# Altium project zynq020.PrjPCB
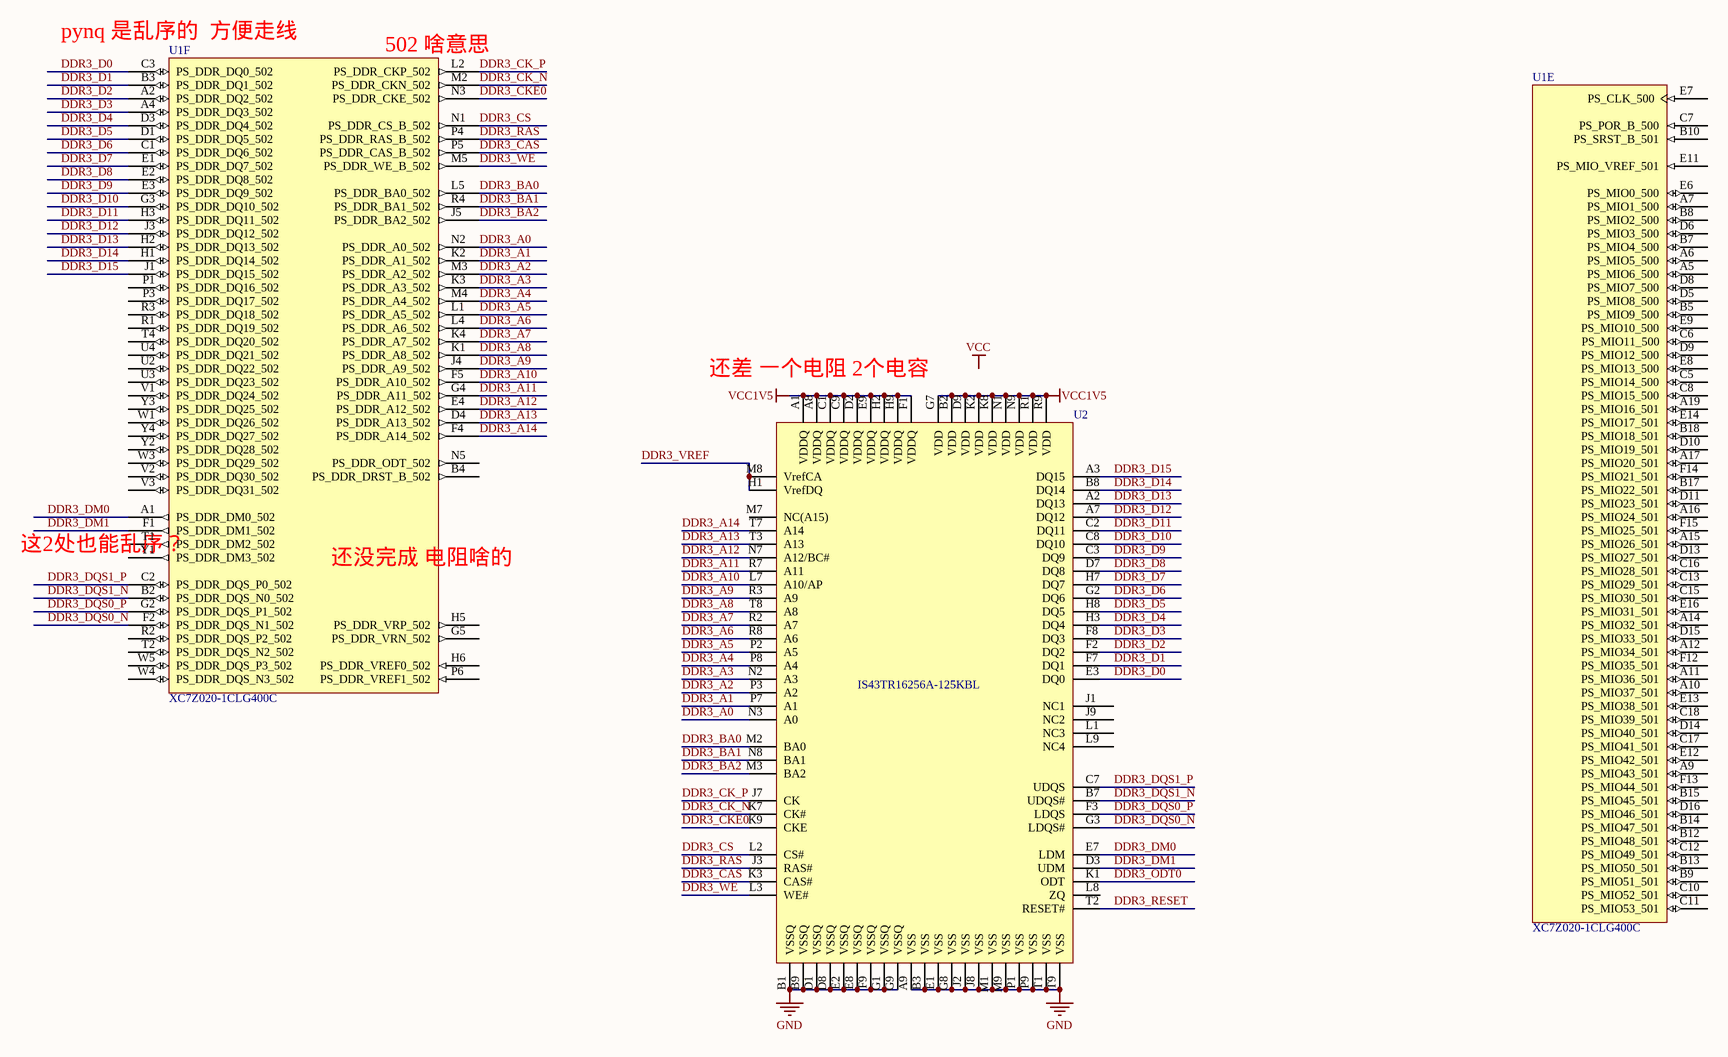
[diagram p0: DDR&MIO.SchDoc]
4 sheets, 54 parts. Net scope: global (net labels, ports and power ports of the same name join across sheets).
Sheets:
  DDR&MIO.SchDoc
  Power&config.SchDoc
  bank.SchDoc
  HDMI.SchDoc

## Sheet DDR&MIO.SchDoc
size A3

### Parts
U1  XC7Z020-1CLG400C  [CLG400]  (parts E,F of 9)
U2  IS43TR16256A-125KBL  [BGA96C80P16X9_1400X900X120]

### Nets
GND: U2.A9(VSS) U2.B1(VSSQ) U2.B3(VSS) U2.B9(VSSQ) U2.D1(VSSQ) U2.D8(VSSQ) U2.E1(VSS) U2.E2(VSSQ) U2.E8(VSSQ) U2.F9(VSSQ) U2.G1(VSSQ) U2.G8(VSS) U2.G9(VSSQ) U2.J2(VSS) U2.J8(VSS) U2.M1(VSS) U2.M9(VSS) U2.P1(VSS) U2.P9(VSS) U2.T1(VSS) U2.T9(VSS)
VCC1V5: U2.A1(VDDQ) U2.A8(VDDQ) U2.B2(VDD) U2.C1(VDDQ) U2.C9(VDDQ) U2.D2(VDDQ) U2.D9(VDD) U2.E9(VDDQ) U2.F1(VDDQ) U2.G7(VDD) U2.H2(VDDQ) U2.H9(VDDQ) U2.K2(VDD) U2.K8(VDD) U2.N1(VDD) U2.N9(VDD) U2.R1(VDD) U2.R9(VDD)
DDR3_A0: U1.N2(PS_DDR_A0_502) U2.N3(A0)
DDR3_A1: U1.K2(PS_DDR_A1_502) U2.P7(A1)
DDR3_A2: U1.M3(PS_DDR_A2_502) U2.P3(A2)
DDR3_A3: U1.K3(PS_DDR_A3_502) U2.N2(A3)
DDR3_A4: U1.M4(PS_DDR_A4_502) U2.P8(A4)
DDR3_A5: U1.L1(PS_DDR_A5_502) U2.P2(A5)
DDR3_A6: U1.L4(PS_DDR_A6_502) U2.R8(A6)
DDR3_A7: U1.K4(PS_DDR_A7_502) U2.R2(A7)
DDR3_A8: U1.K1(PS_DDR_A8_502) U2.T8(A8)
DDR3_A9: U1.J4(PS_DDR_A9_502) U2.R3(A9)
DDR3_A10: U1.F5(PS_DDR_A10_502) U2.L7(A10/AP)
DDR3_A11: U1.G4(PS_DDR_A11_502) U2.R7(A11)
DDR3_A12: U1.E4(PS_DDR_A12_502) U2.N7(A12/BC#)
DDR3_A13: U1.D4(PS_DDR_A13_502) U2.T3(A13)
DDR3_A14: U1.F4(PS_DDR_A14_502) U2.T7(A14)
DDR3_BA0: U1.L5(PS_DDR_BA0_502) U2.M2(BA0)
DDR3_BA1: U1.R4(PS_DDR_BA1_502) U2.N8(BA1)
DDR3_BA2: U1.J5(PS_DDR_BA2_502) U2.M3(BA2)
DDR3_CAS: U1.P5(PS_DDR_CAS_B_502) U2.K3(CAS#)
DDR3_CK_N: U1.M2(PS_DDR_CKN_502) U2.K7(CK#)
DDR3_CK_P: U1.L2(PS_DDR_CKP_502) U2.J7(CK)
DDR3_CKE0: U1.N3(PS_DDR_CKE_502) U2.K9(CKE)
DDR3_CS: U1.N1(PS_DDR_CS_B_502) U2.L2(CS#)
DDR3_D0: U1.C3(PS_DDR_DQ0_502) U2.E3(DQ0)
DDR3_D1: U1.B3(PS_DDR_DQ1_502) U2.F7(DQ1)
DDR3_D2: U1.A2(PS_DDR_DQ2_502) U2.F2(DQ2)
DDR3_D3: U1.A4(PS_DDR_DQ3_502) U2.F8(DQ3)
DDR3_D4: U1.D3(PS_DDR_DQ4_502) U2.H3(DQ4)
DDR3_D5: U1.D1(PS_DDR_DQ5_502) U2.H8(DQ5)
DDR3_D6: U1.C1(PS_DDR_DQ6_502) U2.G2(DQ6)
DDR3_D7: U1.E1(PS_DDR_DQ7_502) U2.H7(DQ7)
DDR3_D8: U1.E2(PS_DDR_DQ8_502) U2.D7(DQ8)
DDR3_D9: U1.E3(PS_DDR_DQ9_502) U2.C3(DQ9)
DDR3_D10: U1.G3(PS_DDR_DQ10_502) U2.C8(DQ10)
DDR3_D11: U1.H3(PS_DDR_DQ11_502) U2.C2(DQ11)
DDR3_D12: U1.J3(PS_DDR_DQ12_502) U2.A7(DQ12)
DDR3_D13: U1.H2(PS_DDR_DQ13_502) U2.A2(DQ13)
DDR3_D14: U1.H1(PS_DDR_DQ14_502) U2.B8(DQ14)
DDR3_D15: U1.J1(PS_DDR_DQ15_502) U2.A3(DQ15)
DDR3_DM0: U1.A1(PS_DDR_DM0_502) U2.E7(LDM)
DDR3_DM1: U1.F1(PS_DDR_DM1_502) U2.D3(UDM)
DDR3_DQS0_N: U1.F2(PS_DDR_DQS_N1_502) U2.G3(LDQS#)
DDR3_DQS0_P: U1.G2(PS_DDR_DQS_P1_502) U2.F3(LDQS)
DDR3_DQS1_N: U1.B2(PS_DDR_DQS_N0_502) U2.B7(UDQS#)
DDR3_DQS1_P: U1.C2(PS_DDR_DQS_P0_502) U2.C7(UDQS)
DDR3_ODT0: U2.K1(ODT)
DDR3_RAS: U1.P4(PS_DDR_RAS_B_502) U2.J3(RAS#)
DDR3_RESET: U2.T2(RESET#)
DDR3_VREF: U2.H1(VrefDQ) U2.M8(VrefCA)
DDR3_WE: U1.M5(PS_DDR_WE_B_502) U2.L3(WE#)

Not connected (* = marked no-connect by the designer): U1 A5(PS_MIO6_500) A6(PS_MIO5_500) A7(PS_MIO1_500) A9(PS_MIO43_501) A10(PS_MIO37_501) A11(PS_MIO36_501) A12(PS_MIO34_501) A14(PS_MIO32_501) A15(PS_MIO26_501) A16(PS_MIO24_501) A17(PS_MIO20_501) A19(PS_MIO16_501) B4(PS_DDR_DRST_B_502) B5(PS_MIO9_500) B7(PS_MIO4_500) B8(PS_MIO2_500) B9(PS_MIO51_501) B10(PS_SRST_B_501) B12(PS_MIO48_501) B13(PS_MIO50_501) B14(PS_MIO47_501) B15(PS_MIO45_501) B17(PS_MIO22_501) B18(PS_MIO18_501) C5(PS_MIO14_500) C6(PS_MIO11_500) C7(PS_POR_B_500) C8(PS_MIO15_500) C10(PS_MIO52_501) C11(PS_MIO53_501) C12(PS_MIO49_501) C13(PS_MIO29_501) C15(PS_MIO30_501) C16(PS_MIO28_501) C17(PS_MIO41_501) C18(PS_MIO39_501) D5(PS_MIO8_500) D6(PS_MIO3_500) D8(PS_MIO7_500) D9(PS_MIO12_500) D10(PS_MIO19_501) D11(PS_MIO23_501) D13(PS_MIO27_501) D14(PS_MIO40_501) D15(PS_MIO33_501) D16(PS_MIO46_501) E6(PS_MIO0_500) E7(PS_CLK_500) E8(PS_MIO13_500) E9(PS_MIO10_500) E11(PS_MIO_VREF_501) E12(PS_MIO42_501) E13(PS_MIO38_501) E14(PS_MIO17_501) E16(PS_MIO31_501) F12(PS_MIO35_501) F13(PS_MIO44_501) F14(PS_MIO21_501) F15(PS_MIO25_501) G5(PS_DDR_VRN_502) H5(PS_DDR_VRP_502) H6(PS_DDR_VREF0_502) N5(PS_DDR_ODT_502) P1(PS_DDR_DQ16_502) P3(PS_DDR_DQ17_502) P6(PS_DDR_VREF1_502) R1(PS_DDR_DQ19_502) R2(PS_DDR_DQS_P2_502) R3(PS_DDR_DQ18_502) T1(PS_DDR_DM2_502) T2(PS_DDR_DQS_N2_502) T4(PS_DDR_DQ20_502) U2(PS_DDR_DQ22_502) U3(PS_DDR_DQ23_502) U4(PS_DDR_DQ21_502) V1(PS_DDR_DQ24_502) V2(PS_DDR_DQ30_502) V3(PS_DDR_DQ31_502) W1(PS_DDR_DQ26_502) W3(PS_DDR_DQ29_502) W4(PS_DDR_DQS_N3_502) W5(PS_DDR_DQS_P3_502) Y1(PS_DDR_DM3_502) Y2(PS_DDR_DQ28_502) Y3(PS_DDR_DQ25_502) Y4(PS_DDR_DQ27_502); U2 J1(NC1) J9(NC2) L1(NC3) L8(ZQ) L9(NC4) M7(NC(A15))

### Notes on the sheet
- (near U1) pynq 是乱序的  方便走线
- (near U1) 502 啥意思
- (near U2) 还差 一个电阻 2个电容
- 这2处也能乱序？
- (near U1) 还没完成 电阻啥的
- Labels drawn without touching a wire or pin: VCC

### Library data of the parts
U1 = XC7Z020-1CLG400C: 667 MHz Zynq?7000 AP SoC, 130 PS I/O, 125 FPGA I/O, 400-Ball BGA, Speed Grade 1, Commercial Grade, Pb-Free; Manufacturer: Xilinx; Extensible Block RAM (# 36Kb Blocks): 560 KB (140); Flip Flops: 106400; LUTs: 53200; Speed Grade: -1; DatasheetVersion: v1.2; PackageVersion: Rev 1.1; PackageReference: CLG400; PackageDescription: Wire-Bond Chip-Scale BGA, Body 17 x 17 mm, 0.8 mm Pitch; Generic Part Number: XC7Z020; RoHS: Pb-Free; Mounting Technology: Surface Mount; Code_JEDEC: MO-275-MMAA-1; PartNumber: XC7Z020-1CLG400C; ComponentLink1Description: Datasheet; ComponentLink1URL: http://www.xilinx.com/support/documentation/data_sheets/ds190-Zynq-7000-Overview.pdf; ComponentLink2Description: Package Specification; ComponentLink2URL: http://www.xilinx.com/support/documentation/user_guides/ug865-Zynq-7000-Pkg-Pinout.pdf; ComponentLink3Description: DC and AC Switching Characteristics; ComponentLink3URL: http://www.xilinx.com/support/documentation/data_sheets/ds187-XC7Z010-XC7Z020-Data-Sheet.pdf; ComponentLink4Description: Package File; ComponentLink4URL: http://www.xilinx.com/support/packagefiles/z7packages/xc7z020clg400pkg.txt; ComponentLink5Description: Packaging and Pinout; ComponentLink5URL: http://www.xilinx.com/support/documentation/user_guides/ug865-Zynq-7000-Pkg-Pinout.pdf; ComponentLink6Description: PCB and Layout Guide; ComponentLink6URL: http://www.xilinx.com/support/documentation/user_guides/ug483_7Series_PCB.pdf
U2 = IS43TR16256A-125KBL: 与MT41K256M16HA-125IT完全兼容

## Sheet Power&config.SchDoc
size A3
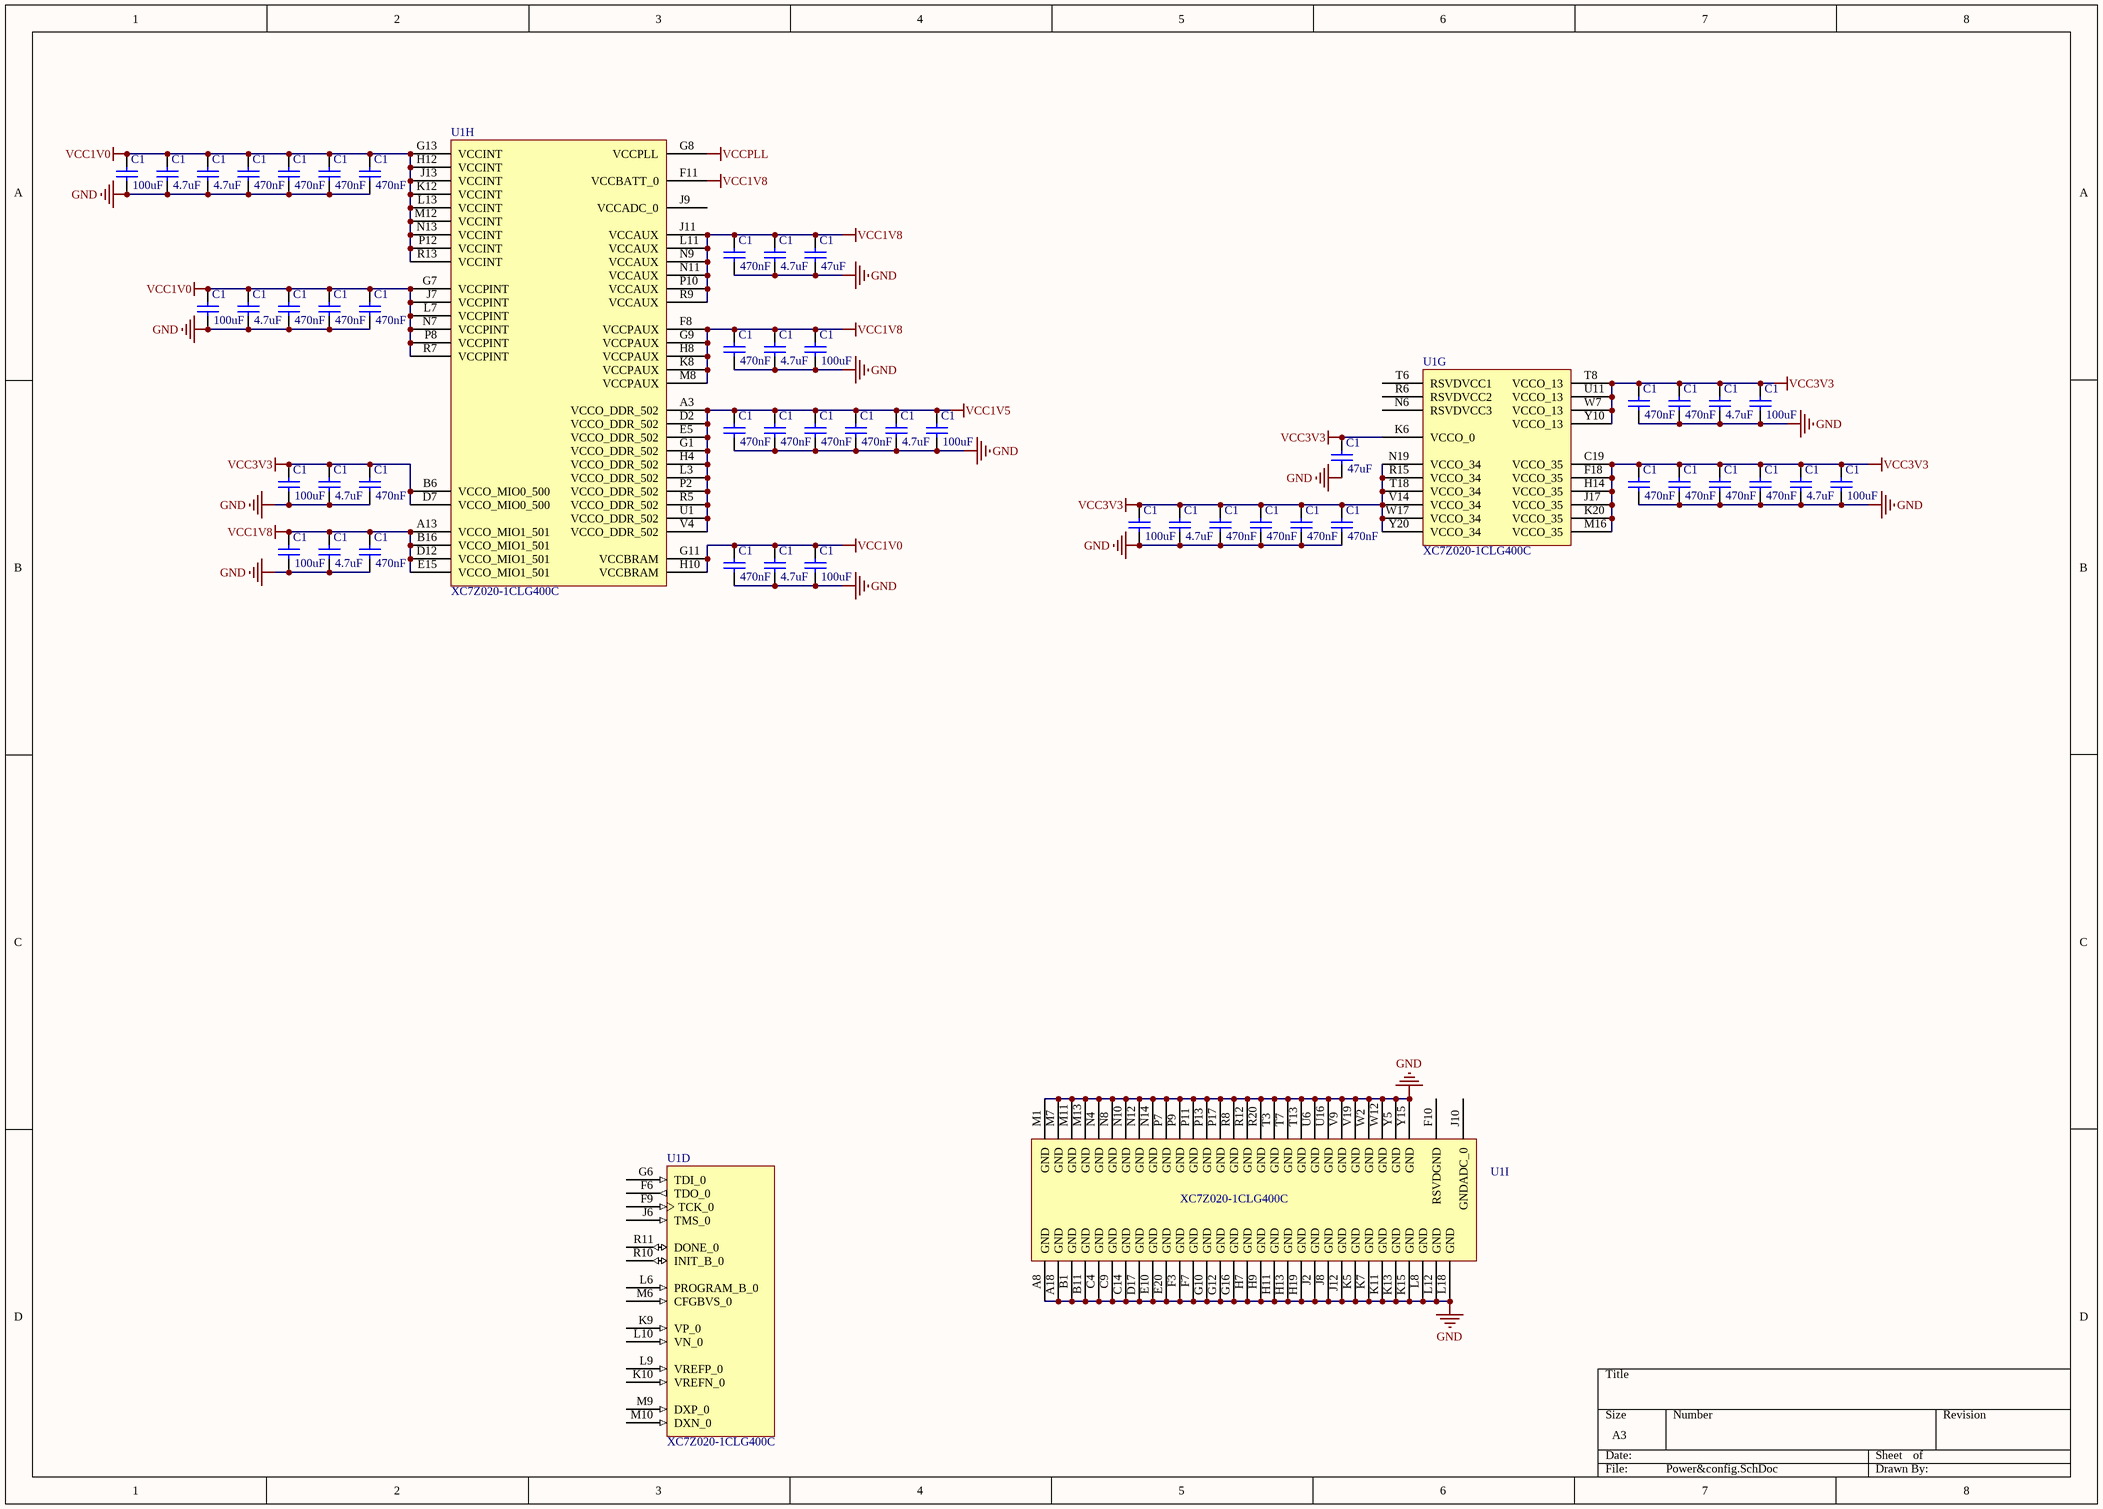
[diagram p1: Power&config.SchDoc]

### Parts
(Parts that share a designator on the sheet are numbered #1, #2 ... from top to bottom, then left to right.)
C1#1  value 100uF  [0402_C]
C1#2  value 4.7uF  [0402_C]
C1#3  value 4.7uF  [0402_C]
C1#4  value 470nF  [0402_C]
C1#5  value 470nF  [0402_C]
C1#6  value 470nF  [0402_C]
C1#7  value 470nF  [0402_C]
C1#8  value 470nF  [0402_C]
C1#9  value 4.7uF  [0402_C]
C1#10  value 47uF  [0402_C]
C1#11  value 100uF  [0402_C]
C1#12  value 4.7uF  [0402_C]
C1#13  value 470nF  [0402_C]
C1#14  value 470nF  [0402_C]
C1#15  value 470nF  [0402_C]
C1#16  value 470nF  [0402_C]
C1#17  value 4.7uF  [0402_C]
C1#18  value 100uF  [0402_C]
C1#19  value 470nF  [0402_C]
C1#20  value 470nF  [0402_C]
C1#21  value 4.7uF  [0402_C]
C1#22  value 100uF  [0402_C]
C1#23  value 470nF  [0402_C]
C1#24  value 470nF  [0402_C]
C1#25  value 470nF  [0402_C]
C1#26  value 470nF  [0402_C]
C1#27  value 4.7uF  [0402_C]
C1#28  value 100uF  [0402_C]
C1#29  value 47uF  [0402_C]
C1#30  value 100uF  [0402_C]
C1#31  value 4.7uF  [0402_C]
C1#32  value 470nF  [0402_C]
C1#33  value 470nF  [0402_C]
C1#34  value 470nF  [0402_C]
C1#35  value 470nF  [0402_C]
C1#36  value 470nF  [0402_C]
C1#37  value 4.7uF  [0402_C]
C1#38  value 100uF  [0402_C]
C1#39  value 100uF  [0402_C]
C1#40  value 4.7uF  [0402_C]
C1#41  value 470nF  [0402_C]
C1#42  value 470nF  [0402_C]
C1#43  value 470nF  [0402_C]
C1#44  value 470nF  [0402_C]
C1#45  value 100uF  [0402_C]
C1#46  value 4.7uF  [0402_C]
C1#47  value 470nF  [0402_C]
C1#48  value 470nF  [0402_C]
C1#49  value 4.7uF  [0402_C]
C1#50  value 100uF  [0402_C]
U1  XC7Z020-1CLG400C  [CLG400]  (parts D,G,H,I of 9)

### Nets
GND: C1#1.1 C1#2.1 C1#3.1 C1#4.1 C1#5.1 C1#6.1 C1#7.1 C1#8.1 C1#9.1 C1#10.1 C1#11.1 C1#12.1 C1#13.1 C1#14.1 C1#15.1 C1#16.1 C1#17.1 C1#18.1 C1#19.1 C1#20.1 C1#21.1 C1#22.1 C1#23.1 C1#24.1 C1#25.1 C1#26.1 C1#27.1 C1#28.1 C1#29.1 C1#30.1 C1#31.1 C1#32.1 C1#33.1 C1#34.1 C1#35.1 C1#36.1 C1#37.1 C1#38.1 C1#39.1 C1#40.1 C1#41.1 C1#42.1 C1#43.1 C1#44.1 C1#45.1 C1#46.1 C1#47.1 C1#48.1 C1#49.1 C1#50.1 U1.A8(GND) U1.A18(GND) U1.B1(GND) U1.B11(GND) U1.C4(GND) U1.C9(GND) U1.C14(GND) U1.D17(GND) U1.E10(GND) U1.E20(GND) U1.F3(GND) U1.F7(GND) U1.G10(GND) U1.G12(GND) U1.G16(GND) U1.H7(GND) U1.H9(GND) U1.H11(GND) U1.H13(GND) U1.H19(GND) U1.J2(GND) U1.J8(GND) U1.J12(GND) U1.K5(GND) U1.K7(GND) U1.K11(GND) U1.K13(GND) U1.K15(GND) U1.L8(GND) U1.L12(GND) U1.L18(GND) U1.M1(GND) U1.M7(GND) U1.M11(GND) U1.M13(GND) U1.N4(GND) U1.N8(GND) U1.N10(GND) U1.N12(GND) U1.N14(GND) U1.P7(GND) U1.P9(GND) U1.P11(GND) U1.P13(GND) U1.P17(GND) U1.R8(GND) U1.R12(GND) U1.R20(GND) U1.T3(GND) U1.T7(GND) U1.T13(GND) U1.U6(GND) U1.U16(GND) U1.V9(GND) U1.V19(GND) U1.W2(GND) U1.W12(GND) U1.Y5(GND) U1.Y15(GND)
VCC1V0: C1#1.2 C1#2.2 C1#3.2 C1#4.2 C1#5.2 C1#6.2 C1#7.2 C1#11.2 C1#12.2 C1#13.2 C1#14.2 C1#15.2 C1#48.2 C1#49.2 C1#50.2 U1.G7(VCCPINT) U1.G11(VCCBRAM) U1.G13(VCCINT) U1.H10(VCCBRAM) U1.H12(VCCINT) U1.J7(VCCPINT) U1.J13(VCCINT) U1.K12(VCCINT) U1.L7(VCCPINT) U1.L13(VCCINT) U1.M12(VCCINT) U1.N7(VCCPINT) U1.N13(VCCINT) U1.P8(VCCPINT) U1.P12(VCCINT) U1.R7(VCCPINT) U1.R13(VCCINT)
VCC1V5: C1#23.2 C1#24.2 C1#25.2 C1#26.2 C1#27.2 C1#28.2 U1.A3(VCCO_DDR_502) U1.D2(VCCO_DDR_502) U1.E5(VCCO_DDR_502) U1.G1(VCCO_DDR_502) U1.H4(VCCO_DDR_502) U1.L3(VCCO_DDR_502) U1.P2(VCCO_DDR_502) U1.R5(VCCO_DDR_502) U1.U1(VCCO_DDR_502) U1.V4(VCCO_DDR_502)
VCC1V8: C1#8.2 C1#9.2 C1#10.2 C1#16.2 C1#17.2 C1#18.2 C1#45.2 C1#46.2 C1#47.2 U1.A13(VCCO_MIO1_501) U1.B16(VCCO_MIO1_501) U1.D12(VCCO_MIO1_501) U1.E15(VCCO_MIO1_501) U1.F8(VCCPAUX) U1.F11(VCCBATT_0) U1.G9(VCCPAUX) U1.H8(VCCPAUX) U1.J11(VCCAUX) U1.K8(VCCPAUX) U1.L11(VCCAUX) U1.M8(VCCPAUX) U1.N9(VCCAUX) U1.N11(VCCAUX) U1.P10(VCCAUX) U1.R9(VCCAUX)
VCC3V3: C1#19.2 C1#20.2 C1#21.2 C1#22.2 C1#29.2 C1#30.2 C1#31.2 C1#32.2 C1#33.2 C1#34.2 C1#35.2 C1#36.2 C1#37.2 C1#38.2 C1#39.2 C1#40.2 C1#41.2 C1#42.2 C1#43.2 C1#44.2 U1.B6(VCCO_MIO0_500) U1.C19(VCCO_35) U1.D7(VCCO_MIO0_500) U1.F18(VCCO_35) U1.H14(VCCO_35) U1.J17(VCCO_35) U1.K6(VCCO_0) U1.K20(VCCO_35) U1.M16(VCCO_35) U1.N19(VCCO_34) U1.R15(VCCO_34) U1.T8(VCCO_13) U1.T18(VCCO_34) U1.U11(VCCO_13) U1.V14(VCCO_34) U1.W7(VCCO_13) U1.W17(VCCO_34) U1.Y10(VCCO_13) U1.Y20(VCCO_34)
VCCPLL: U1.G8(VCCPLL)

Not connected (* = marked no-connect by the designer): U1 F6(TDO_0) F9(TCK_0) F10(RSVDGND) G6(TDI_0) J6(TMS_0) J9(VCCADC_0) J10(GNDADC_0) K9(VP_0) K10(VREFN_0) L6(PROGRAM_B_0) L9(VREFP_0) L10(VN_0) M6(CFGBVS_0) M9(DXP_0) M10(DXN_0) N6(RSVDVCC3) R6(RSVDVCC2) R10(INIT_B_0) R11(DONE_0) T6(RSVDVCC1)

### Library data of the parts
C1#1-C1#50 = Cap: Published: 8-Jun-2000; LatestRevisionDate: 29-May-2009; LatestRevisionNote: IPC-7351 Footprint Added.; PackageReference: C1206; Publisher: Altium Limited; PackageDescription: Chip Capacitor
U1 = XC7Z020-1CLG400C: as U1 on sheet DDR&MIO; DatasheetVersion: v1.2; PackageVersion: Rev 1.1; PackageReference: CLG400; PackageDescription: Wire-Bond Chip-Scale BGA, Body 17 x 17 mm, 0.8 mm Pitch; Generic Part Number: XC7Z020; RoHS: Pb-Free; Mounting Technology: Surface Mount; Code_JEDEC: MO-275-MMAA-1; PartNumber: XC7Z020-1CLG400C; ComponentLink1Description: Datasheet; ComponentLink1URL: http://www.xilinx.com/support/documentation/data_sheets/ds190-Zynq-7000-Overview.pdf; ComponentLink2Description: Package Specification; ComponentLink2URL: http://www.xilinx.com/support/documentation/user_guides/ug865-Zynq-7000-Pkg-Pinout.pdf; ComponentLink3Description: DC and AC Switching Characteristics; ComponentLink3URL: http://www.xilinx.com/support/documentation/data_sheets/ds187-XC7Z010-XC7Z020-Data-Sheet.pdf; ComponentLink4Description: Package File; ComponentLink4URL: http://www.xilinx.com/support/packagefiles/z7packages/xc7z020clg400pkg.txt; ComponentLink5Description: Packaging and Pinout; ComponentLink5URL: http://www.xilinx.com/support/documentation/user_guides/ug865-Zynq-7000-Pkg-Pinout.pdf; ComponentLink6Description: PCB and Layout Guide; ComponentLink6URL: http://www.xilinx.com/support/documentation/user_guides/ug483_7Series_PCB.pdf

## Sheet bank.SchDoc
size A4
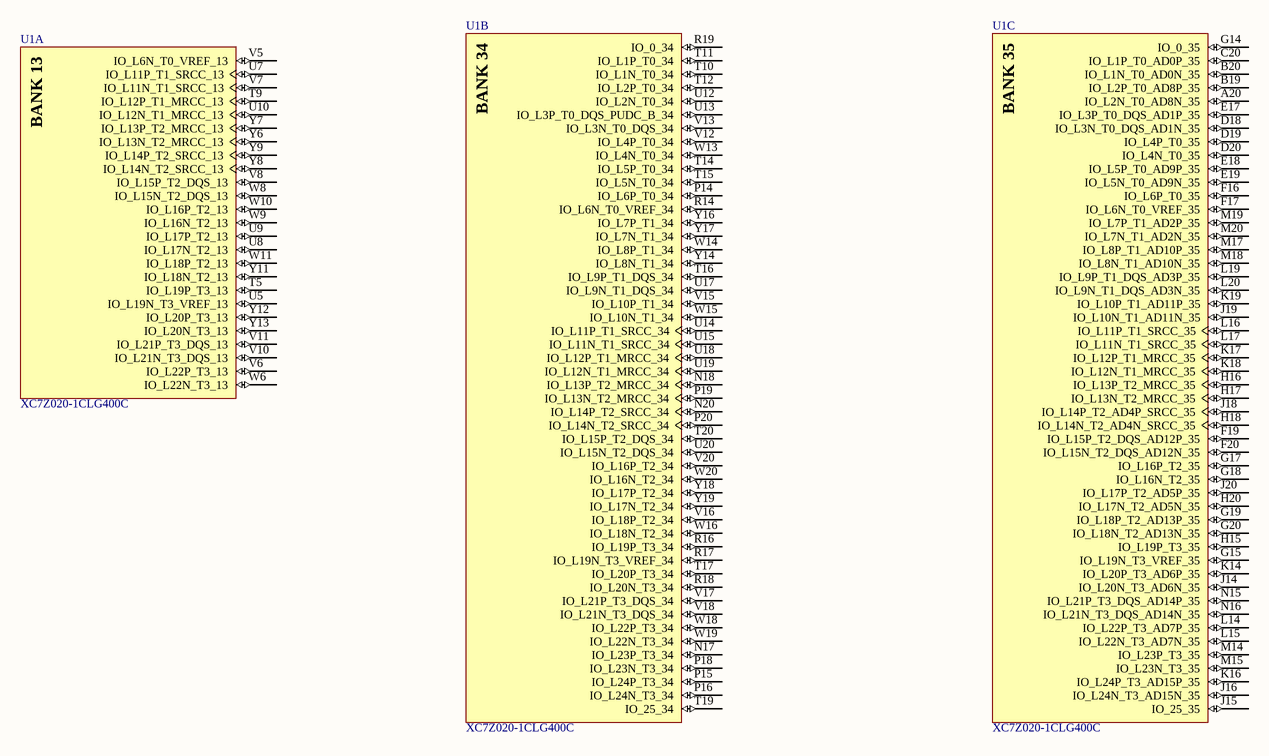
[diagram p2: bank.SchDoc]

### Parts
U1  XC7Z020-1CLG400C  [CLG400]  (parts A,B,C of 9)

### Nets

Not connected (* = marked no-connect by the designer): U1 A20(IO_L2N_T0_AD8N_35) B19(IO_L2P_T0_AD8P_35) B20(IO_L1N_T0_AD0N_35) C20(IO_L1P_T0_AD0P_35) D18(IO_L3N_T0_DQS_AD1N_35) D19(IO_L4P_T0_35) D20(IO_L4N_T0_35) E17(IO_L3P_T0_DQS_AD1P_35) E18(IO_L5P_T0_AD9P_35) E19(IO_L5N_T0_AD9N_35) F16(IO_L6P_T0_35) F17(IO_L6N_T0_VREF_35) F19(IO_L15P_T2_DQS_AD12P_35) F20(IO_L15N_T2_DQS_AD12N_35) G14(IO_0_35) G15(IO_L19N_T3_VREF_35) G17(IO_L16P_T2_35) G18(IO_L16N_T2_35) G19(IO_L18P_T2_AD13P_35) G20(IO_L18N_T2_AD13N_35) H15(IO_L19P_T3_35) H16(IO_L13P_T2_MRCC_35) H17(IO_L13N_T2_MRCC_35) H18(IO_L14N_T2_AD4N_SRCC_35) H20(IO_L17N_T2_AD5N_35) J14(IO_L20N_T3_AD6N_35) J15(IO_25_35) J16(IO_L24N_T3_AD15N_35) J18(IO_L14P_T2_AD4P_SRCC_35) J19(IO_L10N_T1_AD11N_35) J20(IO_L17P_T2_AD5P_35) K14(IO_L20P_T3_AD6P_35) K16(IO_L24P_T3_AD15P_35) K17(IO_L12P_T1_MRCC_35) K18(IO_L12N_T1_MRCC_35) K19(IO_L10P_T1_AD11P_35) L14(IO_L22P_T3_AD7P_35) L15(IO_L22N_T3_AD7N_35) L16(IO_L11P_T1_SRCC_35) L17(IO_L11N_T1_SRCC_35) L19(IO_L9P_T1_DQS_AD3P_35) L20(IO_L9N_T1_DQS_AD3N_35) M14(IO_L23P_T3_35) M15(IO_L23N_T3_35) M17(IO_L8P_T1_AD10P_35) M18(IO_L8N_T1_AD10N_35) M19(IO_L7P_T1_AD2P_35) M20(IO_L7N_T1_AD2N_35) N15(IO_L21P_T3_DQS_AD14P_35) N16(IO_L21N_T3_DQS_AD14N_35) N17(IO_L23P_T3_34) N18(IO_L13P_T2_MRCC_34) N20(IO_L14P_T2_SRCC_34) P14(IO_L6P_T0_34) P15(IO_L24P_T3_34) P16(IO_L24N_T3_34) P18(IO_L23N_T3_34) P19(IO_L13N_T2_MRCC_34) P20(IO_L14N_T2_SRCC_34) R14(IO_L6N_T0_VREF_34) R16(IO_L19P_T3_34) R17(IO_L19N_T3_VREF_34) R18(IO_L20N_T3_34) R19(IO_0_34) T5(IO_L19P_T3_13) T9(IO_L12P_T1_MRCC_13) T10(IO_L1N_T0_34) T11(IO_L1P_T0_34) T12(IO_L2P_T0_34) T14(IO_L5P_T0_34) T15(IO_L5N_T0_34) T16(IO_L9P_T1_DQS_34) T17(IO_L20P_T3_34) T19(IO_25_34) T20(IO_L15P_T2_DQS_34) U5(IO_L19N_T3_VREF_13) U7(IO_L11P_T1_SRCC_13) U8(IO_L17N_T2_13) U9(IO_L17P_T2_13) U10(IO_L12N_T1_MRCC_13) U12(IO_L2N_T0_34) U13(IO_L3P_T0_DQS_PUDC_B_34) U14(IO_L11P_T1_SRCC_34) U15(IO_L11N_T1_SRCC_34) U17(IO_L9N_T1_DQS_34) U18(IO_L12P_T1_MRCC_34) U19(IO_L12N_T1_MRCC_34) U20(IO_L15N_T2_DQS_34) V5(IO_L6N_T0_VREF_13) V6(IO_L22P_T3_13) V7(IO_L11N_T1_SRCC_13) V8(IO_L15P_T2_DQS_13) V10(IO_L21N_T3_DQS_13) V11(IO_L21P_T3_DQS_13) V12(IO_L4P_T0_34) V13(IO_L3N_T0_DQS_34) V15(IO_L10P_T1_34) V16(IO_L18P_T2_34) V17(IO_L21P_T3_DQS_34) V18(IO_L21N_T3_DQS_34) V20(IO_L16P_T2_34) W6(IO_L22N_T3_13) W8(IO_L15N_T2_DQS_13) W9(IO_L16N_T2_13) W10(IO_L16P_T2_13) W11(IO_L18P_T2_13) W13(IO_L4N_T0_34) W14(IO_L8P_T1_34) W15(IO_L10N_T1_34) W16(IO_L18N_T2_34) W18(IO_L22P_T3_34) W19(IO_L22N_T3_34) W20(IO_L16N_T2_34) Y6(IO_L13N_T2_MRCC_13) Y7(IO_L13P_T2_MRCC_13) Y8(IO_L14N_T2_SRCC_13) Y9(IO_L14P_T2_SRCC_13) Y11(IO_L18N_T2_13) Y12(IO_L20P_T3_13) Y13(IO_L20N_T3_13) Y14(IO_L8N_T1_34) Y16(IO_L7P_T1_34) Y17(IO_L7N_T1_34) Y18(IO_L17P_T2_34) Y19(IO_L17N_T2_34)

### Notes on the sheet
- (in symbol XC7Z020-1CLG400C, part A) BANK 13
- (in symbol XC7Z020-1CLG400C, part B) BANK 34
- (in symbol XC7Z020-1CLG400C, part C) BANK 35

### Library data of the parts
U1 = XC7Z020-1CLG400C: as U1 on sheet DDR&MIO; DatasheetVersion: v1.2; PackageVersion: Rev 1.1; PackageReference: CLG400; PackageDescription: Wire-Bond Chip-Scale BGA, Body 17 x 17 mm, 0.8 mm Pitch; Generic Part Number: XC7Z020; RoHS: Pb-Free; Mounting Technology: Surface Mount; Code_JEDEC: MO-275-MMAA-1; PartNumber: XC7Z020-1CLG400C; ComponentLink1Description: Datasheet; ComponentLink1URL: http://www.xilinx.com/support/documentation/data_sheets/ds190-Zynq-7000-Overview.pdf; ComponentLink2Description: Package Specification; ComponentLink2URL: http://www.xilinx.com/support/documentation/user_guides/ug865-Zynq-7000-Pkg-Pinout.pdf; ComponentLink3Description: DC and AC Switching Characteristics; ComponentLink3URL: http://www.xilinx.com/support/documentation/data_sheets/ds187-XC7Z010-XC7Z020-Data-Sheet.pdf; ComponentLink4Description: Package File; ComponentLink4URL: http://www.xilinx.com/support/packagefiles/z7packages/xc7z020clg400pkg.txt; ComponentLink5Description: Packaging and Pinout; ComponentLink5URL: http://www.xilinx.com/support/documentation/user_guides/ug865-Zynq-7000-Pkg-Pinout.pdf; ComponentLink6Description: PCB and Layout Guide; ComponentLink6URL: http://www.xilinx.com/support/documentation/user_guides/ug483_7Series_PCB.pdf

## Sheet HDMI.SchDoc
size A4
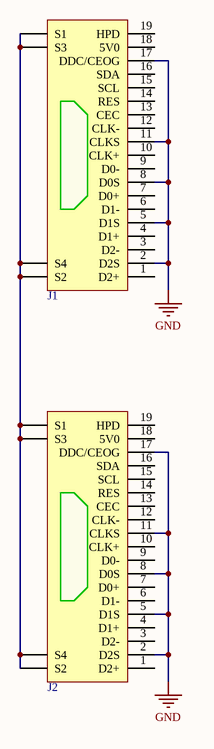
[diagram p3: HDMI.SchDoc]

### Parts
J1  HDMI  (value not drawn)
J2  HDMI  (value not drawn)

### Nets
GND: J1.2(D2S) J1.5(D1S) J1.8(D0S) J1.11(CLKS) J1.17(DDC/CEOG) J2.2(D2S) J2.5(D1S) J2.8(D0S) J2.11(CLKS) J2.17(DDC/CEOG)
NetJ1_?1: J1.?1(S1) J1.?2(S2) J1.?3(S3) J1.?4(S4) J2.?1(S1) J2.?2(S2) J2.?3(S3) J2.?4(S4)

Not connected (* = marked no-connect by the designer): J1 1(D2+) 3(D2-) 4(D1+) 6(D1-) 7(D0+) 9(D0-) 10(CLK+) 12(CLK-) 13(CEC) 14(RES) 15(SCL) 16(SDA) 18(5V0) 19(HPD); J2 1(D2+) 3(D2-) 4(D1+) 6(D1-) 7(D0+) 9(D0-) 10(CLK+) 12(CLK-) 13(CEC) 14(RES) 15(SCL) 16(SDA) 18(5V0) 19(HPD)

## Nets that join several sheets
GND: DDR&MIO (21 pins), Power&config (109 pins), HDMI (10 pins)
VCC1V5: DDR&MIO (18 pins), Power&config (16 pins)